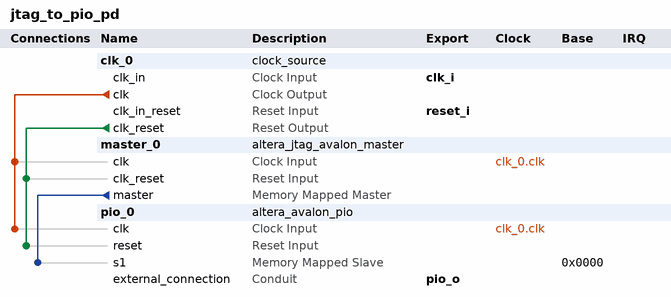
[diagram p0: system contents]
# Platform Designer (Qsys) system jtag_to_pio_pd, Cyclone IV E EP4CE22F17C6
# Parameters at their usual value, and those the tool derives, are not listed.
package require -exact qsys 22.1
create_system jtag_to_pio_pd
set_project_property DEVICE_FAMILY {Cyclone IV E}
set_project_property DEVICE EP4CE22F17C6

add_instance clk_0 clock_source 22.1
set_instance_parameter_value clk_0 clockFrequency 50000000
set_instance_parameter_value clk_0 resetSynchronousEdges DEASSERT

add_instance master_0 altera_jtag_avalon_master 22.1

add_instance pio_0 altera_avalon_pio 22.1
set_instance_parameter_value pio_0 direction Output
set_instance_parameter_value pio_0 width 8

# connections
add_connection clk_0.clk master_0.clk clock
add_connection clk_0.clk pio_0.clk clock
add_connection clk_0.clk_reset master_0.clk_reset reset
add_connection clk_0.clk_reset pio_0.reset reset
add_connection master_0.master pio_0.s1 avalon
set_connection_parameter_value master_0.master/pio_0.s1 baseAddress 0x0000

# exported interfaces
add_interface clk_i clock sink
set_interface_property clk_i EXPORT_OF clk_0.clk_in
add_interface pio_o conduit end
set_interface_property pio_o EXPORT_OF pio_0.external_connection
add_interface reset_i reset sink
set_interface_property reset_i EXPORT_OF clk_0.clk_in_reset

set_interconnect_requirement {$system} qsys_mm.clockCrossingAdapter HANDSHAKE
set_interconnect_requirement {$system} qsys_mm.enableEccProtection FALSE
set_interconnect_requirement {$system} qsys_mm.insertDefaultSlave FALSE
set_interconnect_requirement {$system} qsys_mm.maxAdditionalLatency 1

save_system jtag_to_pio_pd.qsys
